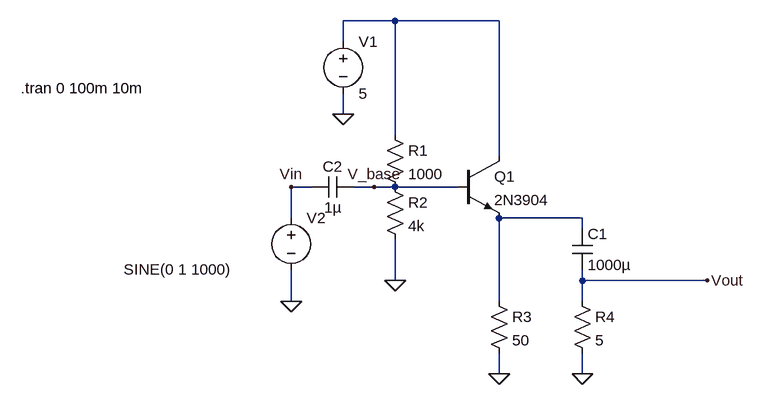
[diagram p0: schematic amplifier_circuit_output.asc]
amplifier_circuit_output.asc, the LTspice schematic file:
Version 4
SHEET 1 880 680
WIRE 0 -144 -80 -144
WIRE 160 -144 0 -144
WIRE -80 -112 -80 -144
WIRE -80 0 -80 -32
WIRE 0 32 0 -144
WIRE 160 64 160 -144
WIRE -128 112 -160 112
WIRE -32 112 -64 112
WIRE 0 112 -32 112
WIRE 96 112 0 112
WIRE -160 160 -160 112
WIRE 288 160 160 160
WIRE 288 176 288 160
WIRE 0 256 0 192
WIRE 288 256 288 240
WIRE 480 256 288 256
WIRE -160 288 -160 240
WIRE 160 288 160 160
WIRE 288 288 288 256
WIRE 160 400 160 368
WIRE 288 400 288 368
FLAG -80 0 0
FLAG -160 288 0
FLAG 0 256 0
FLAG 288 400 0
FLAG 480 256 Vout
FLAG 160 400 0
FLAG -160 112 Vin
FLAG -32 112 V_base
SYMBOL npn 96 64 R0
SYMATTR InstName Q1
SYMATTR Value 2N3904
SYMBOL voltage -80 -128 R0
WINDOW 123 0 0 Left 2
WINDOW 39 0 0 Left 2
SYMATTR InstName V1
SYMATTR Value 5
SYMBOL voltage -160 144 R0
WINDOW 3 -258 95 Left 2
WINDOW 123 0 0 Left 2
WINDOW 39 0 0 Left 2
SYMATTR Value SINE(0 1 1000)
SYMATTR InstName V2
SYMBOL res -16 16 R0
SYMATTR InstName R1
SYMATTR Value 1000
SYMBOL res -16 96 R0
SYMATTR InstName R2
SYMATTR Value 4k
SYMBOL res 272 272 R0
SYMATTR InstName R4
SYMATTR Value 5
SYMBOL cap -64 96 R90
WINDOW 0 0 32 VBottom 2
WINDOW 3 32 32 VTop 2
SYMATTR InstName C2
SYMATTR Value 1µ
SYMBOL res 144 272 R0
SYMATTR InstName R3
SYMATTR Value 50
SYMBOL cap 272 176 R0
SYMATTR InstName C1
SYMATTR Value 1000µ
TEXT -576 -40 Left 2 !.tran 0 100m 10m

The netlist it stands for:
* amplifier_circuit_output.asc
Q1 N001 V_base N002 0 2N3904
V1 N001 0 5
V2 Vin 0 SINE(0 1 1000)
R1 N001 V_base 1000
R2 V_base 0 4k
R4 Vout 0 5
C2 V_base Vin 1µ
R3 N002 0 50
C1 N002 Vout 1000µ
.model NPN NPN
.model PNP PNP
.lib standard.bjt
.tran 0 100m 10m
.backanno
.end